# EasyEDA schematic 1-Schematic_electronic_khipu_2.json
TITLE: Sheet_1; REV: 1.0; Date: 2021-06-27; Sheet: 1/1; Company: Your Company
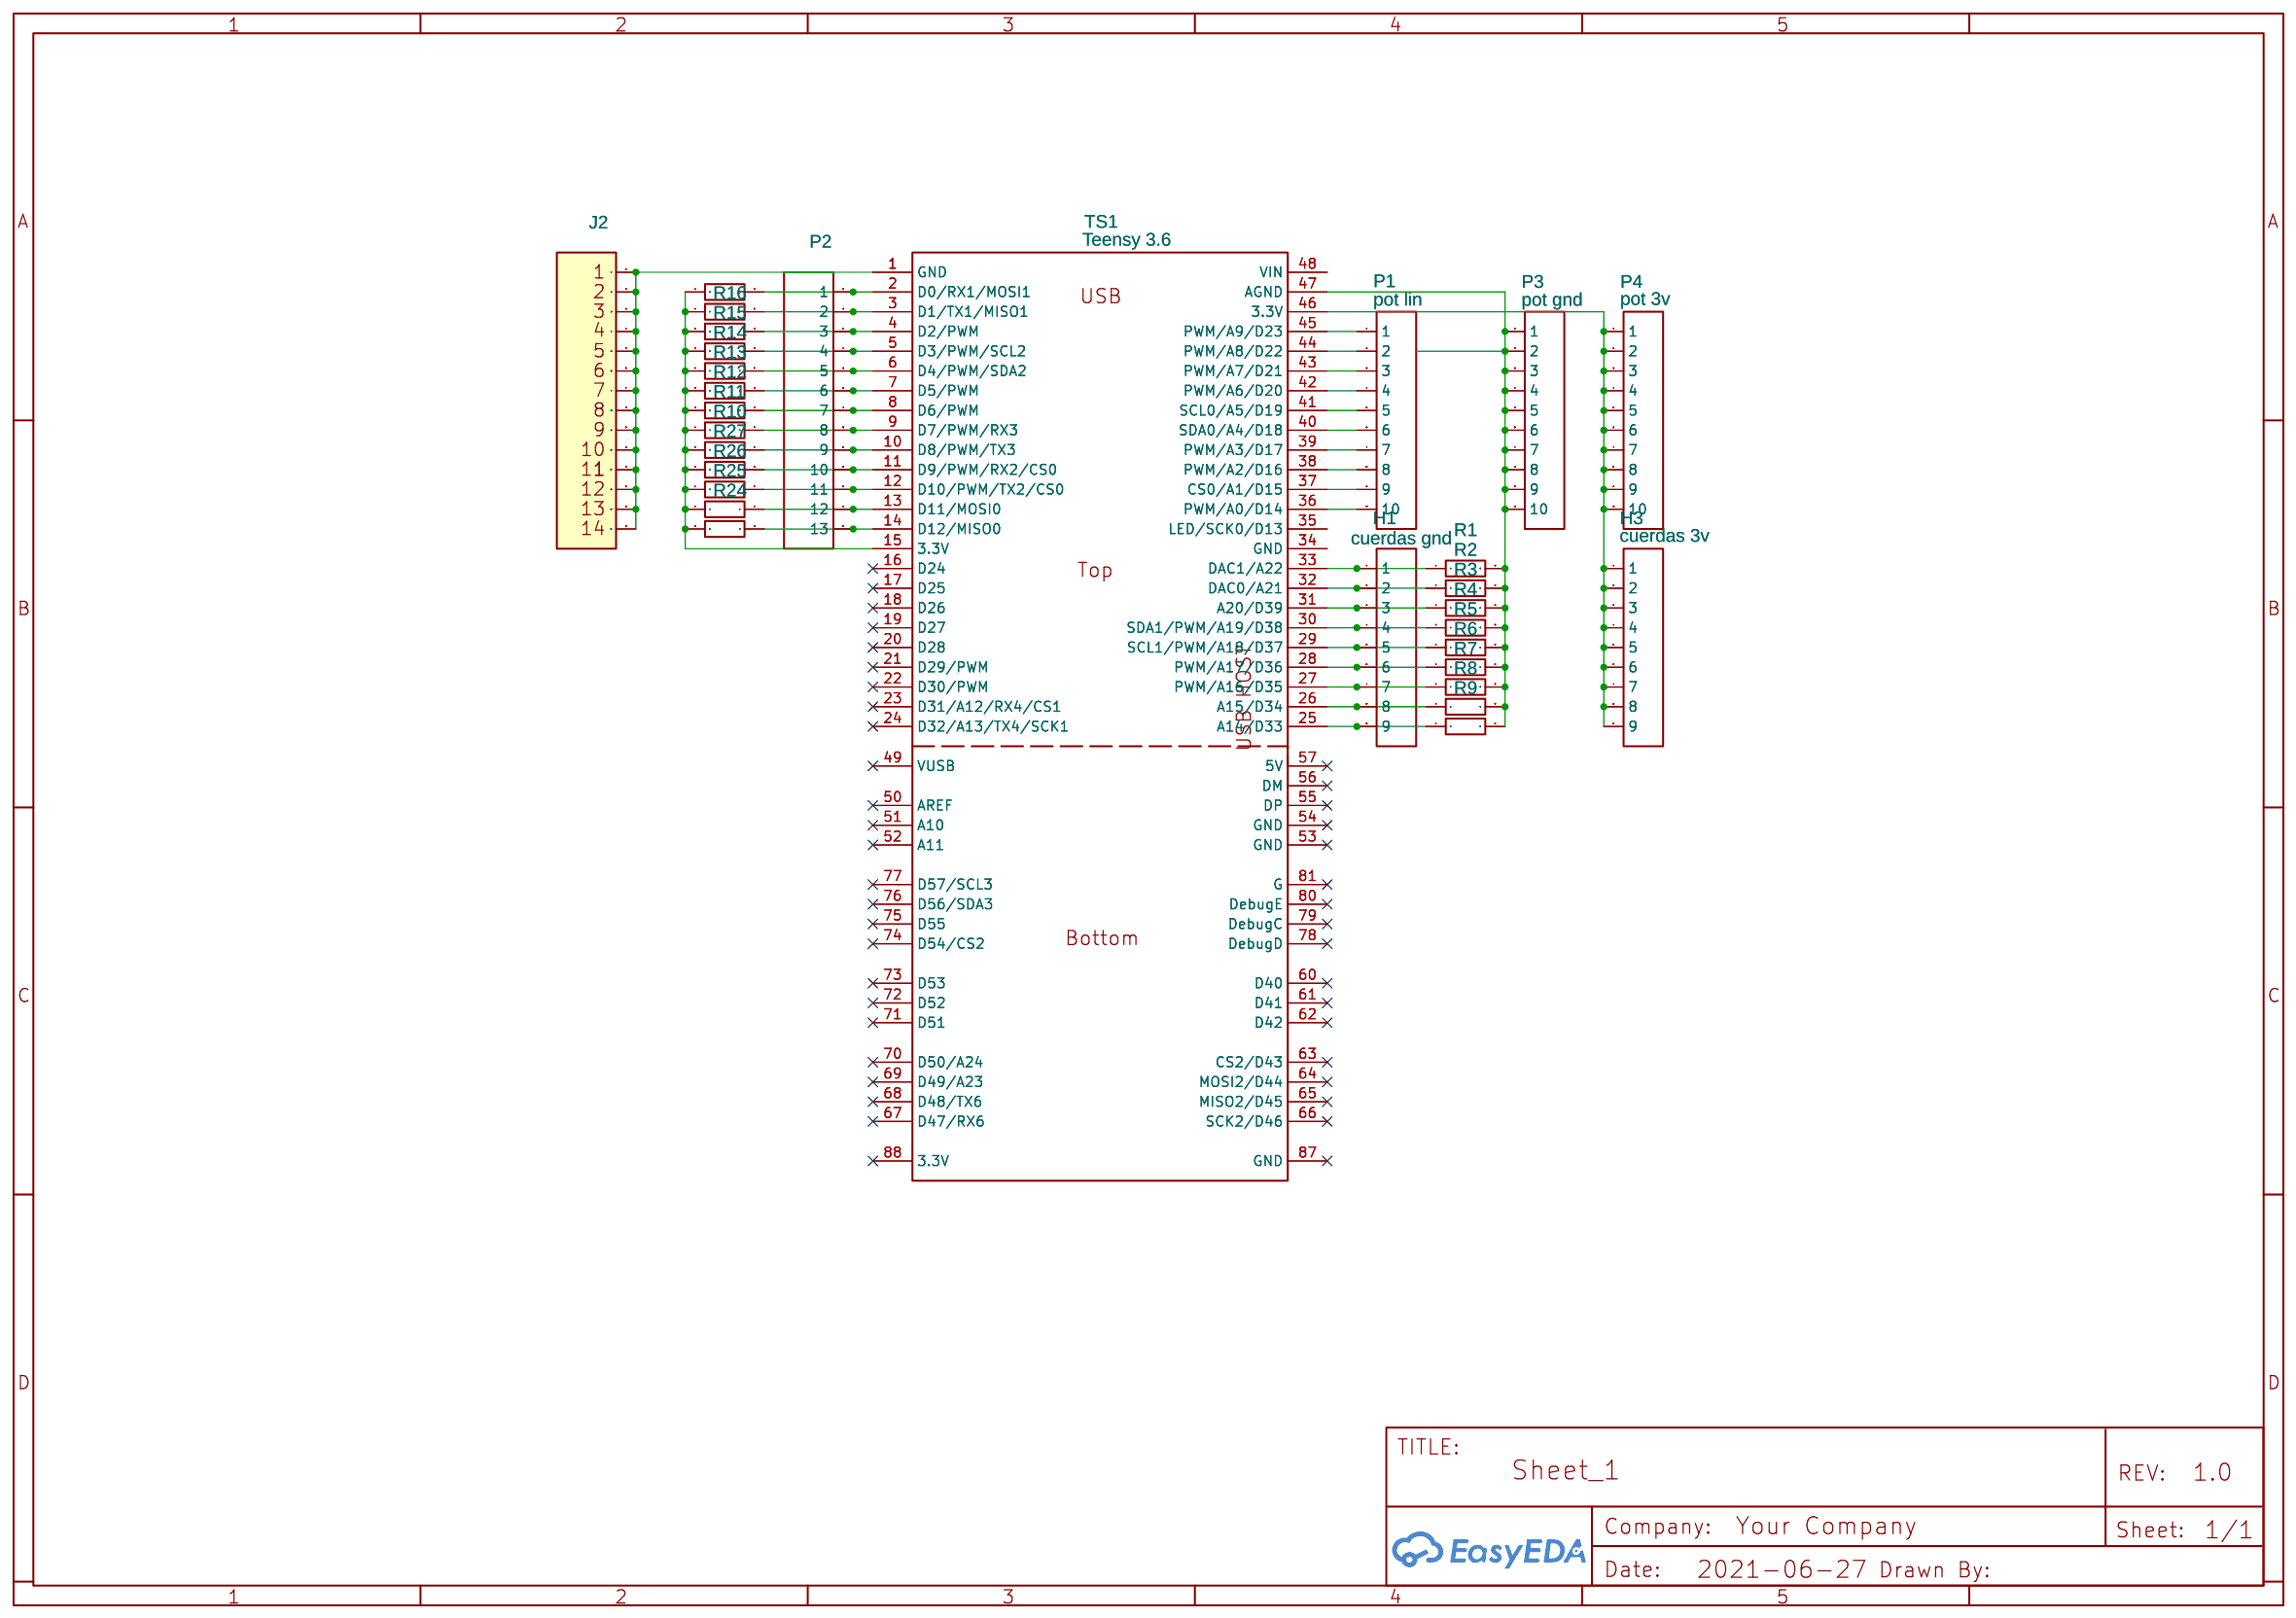
[diagram p0: schematic sheet]

## Parts
H1  cuerdas gnd  [HDR-TH_9P-P2.54-V]
H3  cuerdas 3v  [HDR-TH_9P-P2.54-V]
J2  Header_Female_1x14  [HEADER_FEMALE_1X14]
P1  pot lin  [HDR-10X1/2.54]
P2  Header-Female-2.54_1x13  [HDR-TH_13P-P2.54-V]
P3  pot gnd  [HDR-10X1/2.54]
P4  pot 3v  [HDR-10X1/2.54]
R1  10K  [R0603]
R2  10K  [R0603]
R3  10K  [R0603]
R4  10K  [R0603]
R5  10K  [R0603]
R6  10K  [R0603]
R7  10K  [R0603]
R8  10K  [R0603]
R9  10K  [R0603]
R10  10K  [R0603]
R11  10K  [R0603]
R12  10K  [R0603]
R13  10K  [R0603]
R14  10K  [R0603]
R15  10K  [R0603]
R16  10K  [R0603]
R17  10K  [R0603]
R18  10K  [R0603]
R24  10K  [R0603]
R25  10K  [R0603]
R26  10K  [R0603]
R27  10K  [R0603]
TS1  Teensy 3.6  [TEENSY 3.6-BT]

## Library data of the parts
H1 H3 = Header-Female-2.54_1x9: Supplier: LCSC; Manufacturer: BOOMELE; Manufacturer Part: 2.54mm 1*9 Straight Female header; Supplier Part: C39576; JLCPCB Part Class: Extended Part
J2 = Header_Female_1x14: Header, 14-Pin; sourceId: xQ2CAaKHF; Contributor: scorp05
P1 P3 P4 = Header-Female-2.54_1x10-TEST: Supplier: LCSC; Manufacturer: BOOMELE; Manufacturer Part: 2.54mm 1*10P Straight Female header Gold-plated; Supplier Part: C35445; Contributor: Евгений Смирнов
P2 = Header-Female-2.54_1x13: Supplier: LCSC; Manufacturer: BOOMELE; Manufacturer Part: Female header 2.54-1*13P; Supplier Part: C52709; JLCPCB Part Class: Extended Part
R1-R18 R24-R27 = PTFR0603B10K0P9: Supplier: LCSC; Supplier Part: C328421; Manufacturer: ResistorToday; Contributor: LCSC
TS1 = Teensy 3.6: Manufacturer Part: TEENSY36; Supplier: PJRC; Link: https://www.pjrc.com/store/teensy36.html; Price (USD): 29.25; Contributor: inge_123

## Nets
Net-(H1-1): H1.1 R1.1 TS1.33(DAC1/A22)
Net-(H1-2): H1.2 R2.1 TS1.32(DAC0/A21)
Net-(H1-3): H1.3 R3.1 TS1.31(A20/D39)
Net-(H1-4): H1.4 R4.1 TS1.30(SDA1/PWM/A19/D38)
Net-(H1-5): H1.5 R5.1 TS1.29(SCL1/PWM/A18/D37)
Net-(H1-6): H1.6 R6.1 TS1.28(PWM/A17/D36)
Net-(H1-7): H1.7 R7.1 TS1.27(PWM/A16/D35)
Net-(H1-8): H1.8 R8.1 TS1.26(A15/D34)
Net-(H1-9): H1.9 R9.1 TS1.25(A14/D33)
Net-(H3-1): H3.1 H3.2 H3.3 H3.4 H3.5 H3.6 H3.7 H3.8 H3.9 P4.1 P4.2 P4.3 P4.4 P4.5 P4.6 P4.7 P4.8 P4.9 P4.10 TS1.46(3.3V)
Net-(J2-1): J2.1 J2.2 J2.3 J2.4 J2.5 J2.6 J2.7 J2.8 J2.9 J2.10 J2.11 J2.12 J2.13 J2.14 TS1.1(GND)
Net-(P1-1): P1.1 TS1.45(PWM/A9/D23)
Net-(P1-2): P1.2 TS1.44(PWM/A8/D22)
Net-(P1-3): P1.3 TS1.43(PWM/A7/D21)
Net-(P1-4): P1.4 TS1.42(PWM/A6/D20)
Net-(P1-5): P1.5 TS1.41(SCL0/A5/D19)
Net-(P1-6): P1.6 TS1.40(SDA0/A4/D18)
Net-(P1-7): P1.7 TS1.39(PWM/A3/D17)
Net-(P1-8): P1.8 TS1.38(PWM/A2/D16)
Net-(P1-9): P1.9 TS1.37(CS0/A1/D15)
Net-(P1-10): P1.10 TS1.36(PWM/A0/D14)
Net-(P2-1): P2.1 R18.2 TS1.2(D0/RX1/MOSI1)
Net-(P2-2): P2.2 R17.2 TS1.3(D1/TX1/MISO1)
Net-(P2-3): P2.3 R16.2 TS1.4(D2/PWM)
Net-(P2-4): P2.4 R15.2 TS1.5(D3/PWM/SCL2)
Net-(P2-5): P2.5 R14.2 TS1.6(D4/PWM/SDA2)
Net-(P2-6): P2.6 R13.2 TS1.7(D5/PWM)
Net-(P2-7): P2.7 R12.2 TS1.8(D6/PWM)
Net-(P2-8): P2.8 R11.2 TS1.9(D7/PWM/RX3)
Net-(P2-9): P2.9 R10.2 TS1.10(D8/PWM/TX3)
Net-(P2-10): P2.10 R27.2 TS1.11(D9/PWM/RX2/CS0)
Net-(P2-11): P2.11 R26.2 TS1.12(D10/PWM/TX2/CS0)
Net-(P2-12): P2.12 R25.2 TS1.13(D11/MOSI0)
Net-(P2-13): P2.13 R24.2 TS1.14(D12/MISO0)
Net-(P3-1): P3.1 P3.2 P3.3 P3.4 P3.5 P3.6 P3.7 P3.8 P3.9 P3.10 R1.2 R2.2 R3.2 R4.2 R5.2 R6.2 R7.2 R8.2 R9.2 TS1.47(AGND)
Net-(R10-1): R10.1 R11.1 R12.1 R13.1 R14.1 R15.1 R16.1 R17.1 R18.1 R24.1 R25.1 R26.1 R27.1 TS1.15(3.3V)

Not connected (* = marked no-connect by the designer): TS1 16(D24)* 17(D25)* 18(D26)* 19(D27)* 20(D28)* 21(D29/PWM)* 22(D30/PWM)* 23(D31/A12/RX4/CS1)* 24(D32/A13/TX4/SCK1)* 34(GND) 35(LED/SCK0/D13) 48(VIN) 49(VUSB)* 50(AREF)* 51(A10)* 52(A11)* 53(GND)* 54(GND)* 55(DP)* 56(DM)* 57(5V)* 60(D40)* 61(D41)* 62(D42)* 63(CS2/D43)* 64(MOSI2/D44)* 65(MISO2/D45)* 66(SCK2/D46)* 67(D47/RX6)* 68(D48/TX6)* 69(D49/A23)* 70(D50/A24)* 71(D51)* 72(D52)* 73(D53)* 74(D54/CS2)* 75(D55)* 76(D56/SDA3)* 77(D57/SCL3)* 78(DebugD)* 79(DebugC)* 80(DebugE)* 81(G)* 87(GND)* 88(3.3V)*
